# EAGLE design MainBoard (EAGLE 7.1.0)
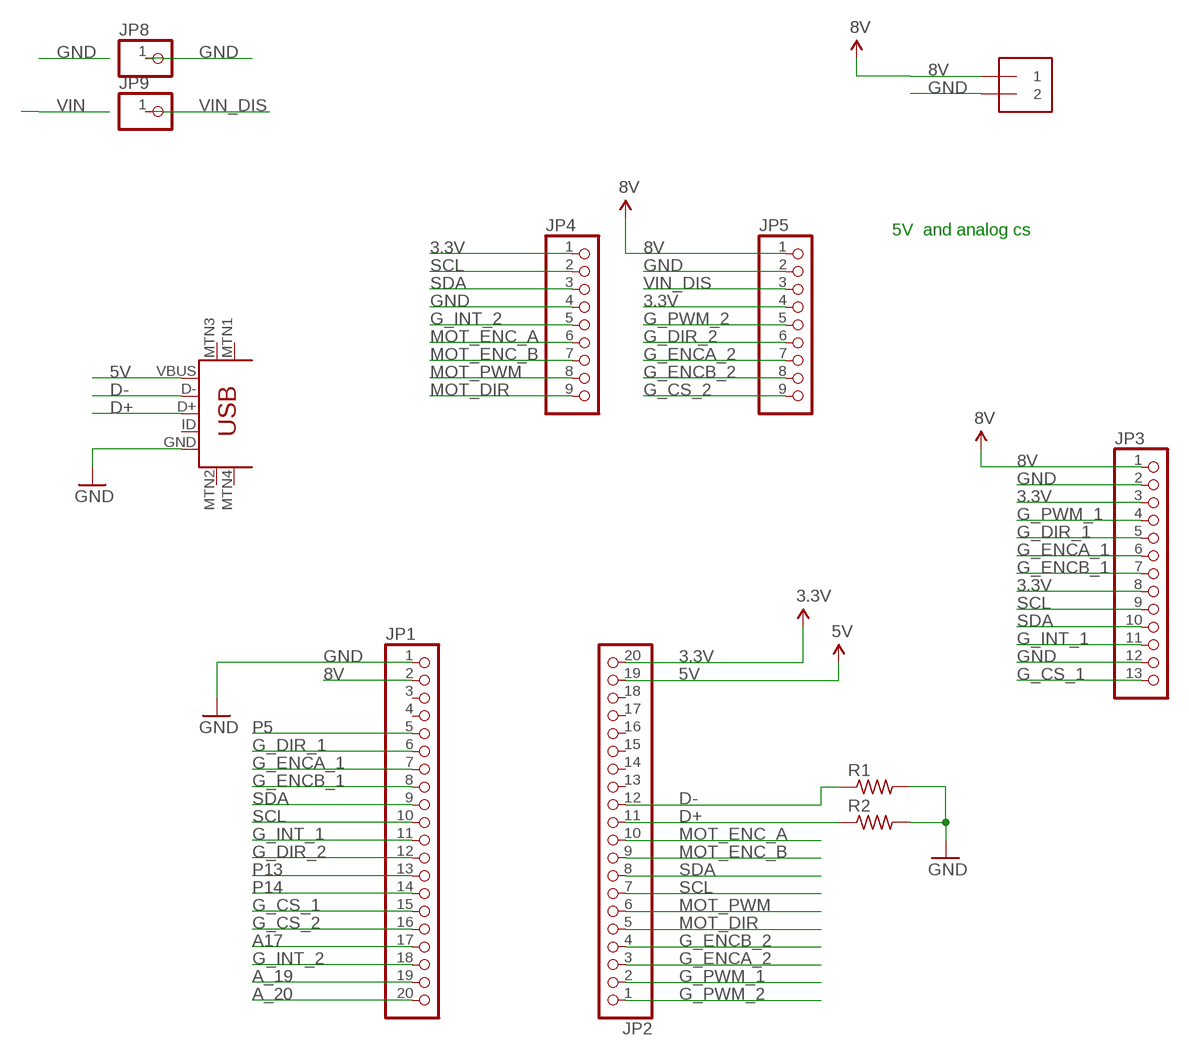
[diagram p0: schematic, sheet 1]

## Parts
J1  1X2-3.5MM  [1X2-3.5MM]
JP1  PINHD-1X20  [1X20]
JP2  PINHD-1X20  [1X20]
JP3  PINHD-1X13  [1X13]
JP4  PINHD-1X9  [1X09-BIG]
JP5  PINHD-1X9  [1X09-BIG]
JP8  PINHD-1X1  [1X01]
JP9  PINHD-1X1  [1X01]
R1  RES-US1206  [R1206]
R2  RES-US1206  [R1206]
U$1  USB-MINIB-5PIN  [USB-MINIB]

## Nets
3.3V: JP2.20 JP3.3 JP3.8 JP4.1 JP5.4
5V: JP2.19 U$1.VBUS
8V: J1.1 JP1.2 JP3.1 JP5.1
A17: JP1.17
A_19: JP1.19
A_20: JP1.20
D+: JP2.11 R2.1 U$1.D+
D-: JP2.12 R1.1 U$1.D-
G_CS_1: JP1.15 JP3.13
G_CS_2: JP1.16 JP5.9
G_DIR_1: JP1.6 JP3.5
G_DIR_2: JP1.12 JP5.6
G_ENCA_1: JP1.7 JP3.6
G_ENCA_2: JP2.3 JP5.7
G_ENCB_1: JP1.8 JP3.7
G_ENCB_2: JP2.4 JP5.8
G_INT_1: JP1.11 JP3.11
G_INT_2: JP1.18 JP4.5
G_PWM_1: JP2.2 JP3.4
G_PWM_2: JP2.1 JP5.5
GND: J1.2 JP1.1 JP3.2 JP3.12 JP4.4 JP5.2 JP8.1 R1.2 R2.2 U$1.GND
MOT_DIR: JP2.5 JP4.9
MOT_ENC_A: JP2.10 JP4.6
MOT_ENC_B: JP2.9 JP4.7
MOT_PWM: JP2.6 JP4.8
P5: JP1.5
P13: JP1.13
P14: JP1.14
SCL: JP1.10 JP2.7 JP3.9 JP4.2
SDA: JP1.9 JP2.8 JP3.10 JP4.3
VIN_DIS: JP5.3 JP9.1
Unconnected: JP1.3 JP1.4 JP2.13 JP2.14 JP2.15 JP2.16 JP2.17 JP2.18 U$1.ID U$1.MTN1(MTN2) U$1.MTN2(MTN3) U$1.MTN3(MTN1) U$1.MTN4

## Notes on the sheet
- 5V  and analog cs

## Library data of the parts
J1 = adafruit:1X2: 3.5mm Terminal block http://www.ladyada.net/library/pcb/eaglelibrary.html
JP1 JP2 = adafruit:PINHD-1X20: PIN HEADER
JP3 = adafruit:PINHD-1X13: PIN HEADER
JP4 JP5 = adafruit:PINHD-1X9: Pin header 1x10 0.1" spacing With round pins
JP8 JP9 = adafruit:PINHD-1X1: Pin header 1x1 for 0.1" spacing With round pins
R1 R2 = fab:RES-US: Resistor (US Symbol) Variants with postfix FAB are widened to allow the routing of internal traces
U$1 = SparkFun:USB-MINIB: Mini-USB "B" connector with 5th pin broken out. Created new symbol breaking out 5th "ID" pin in mini/micro USB connector spec. See: http://en.wikipedia.org/wiki/Mini_usb#Cables. Uses same footprint as 4-pin symbol. Also added pins to connect to mounting / shield pads if required (probably not generally needed as signals aren't shielded once they leave the connector).

## Board
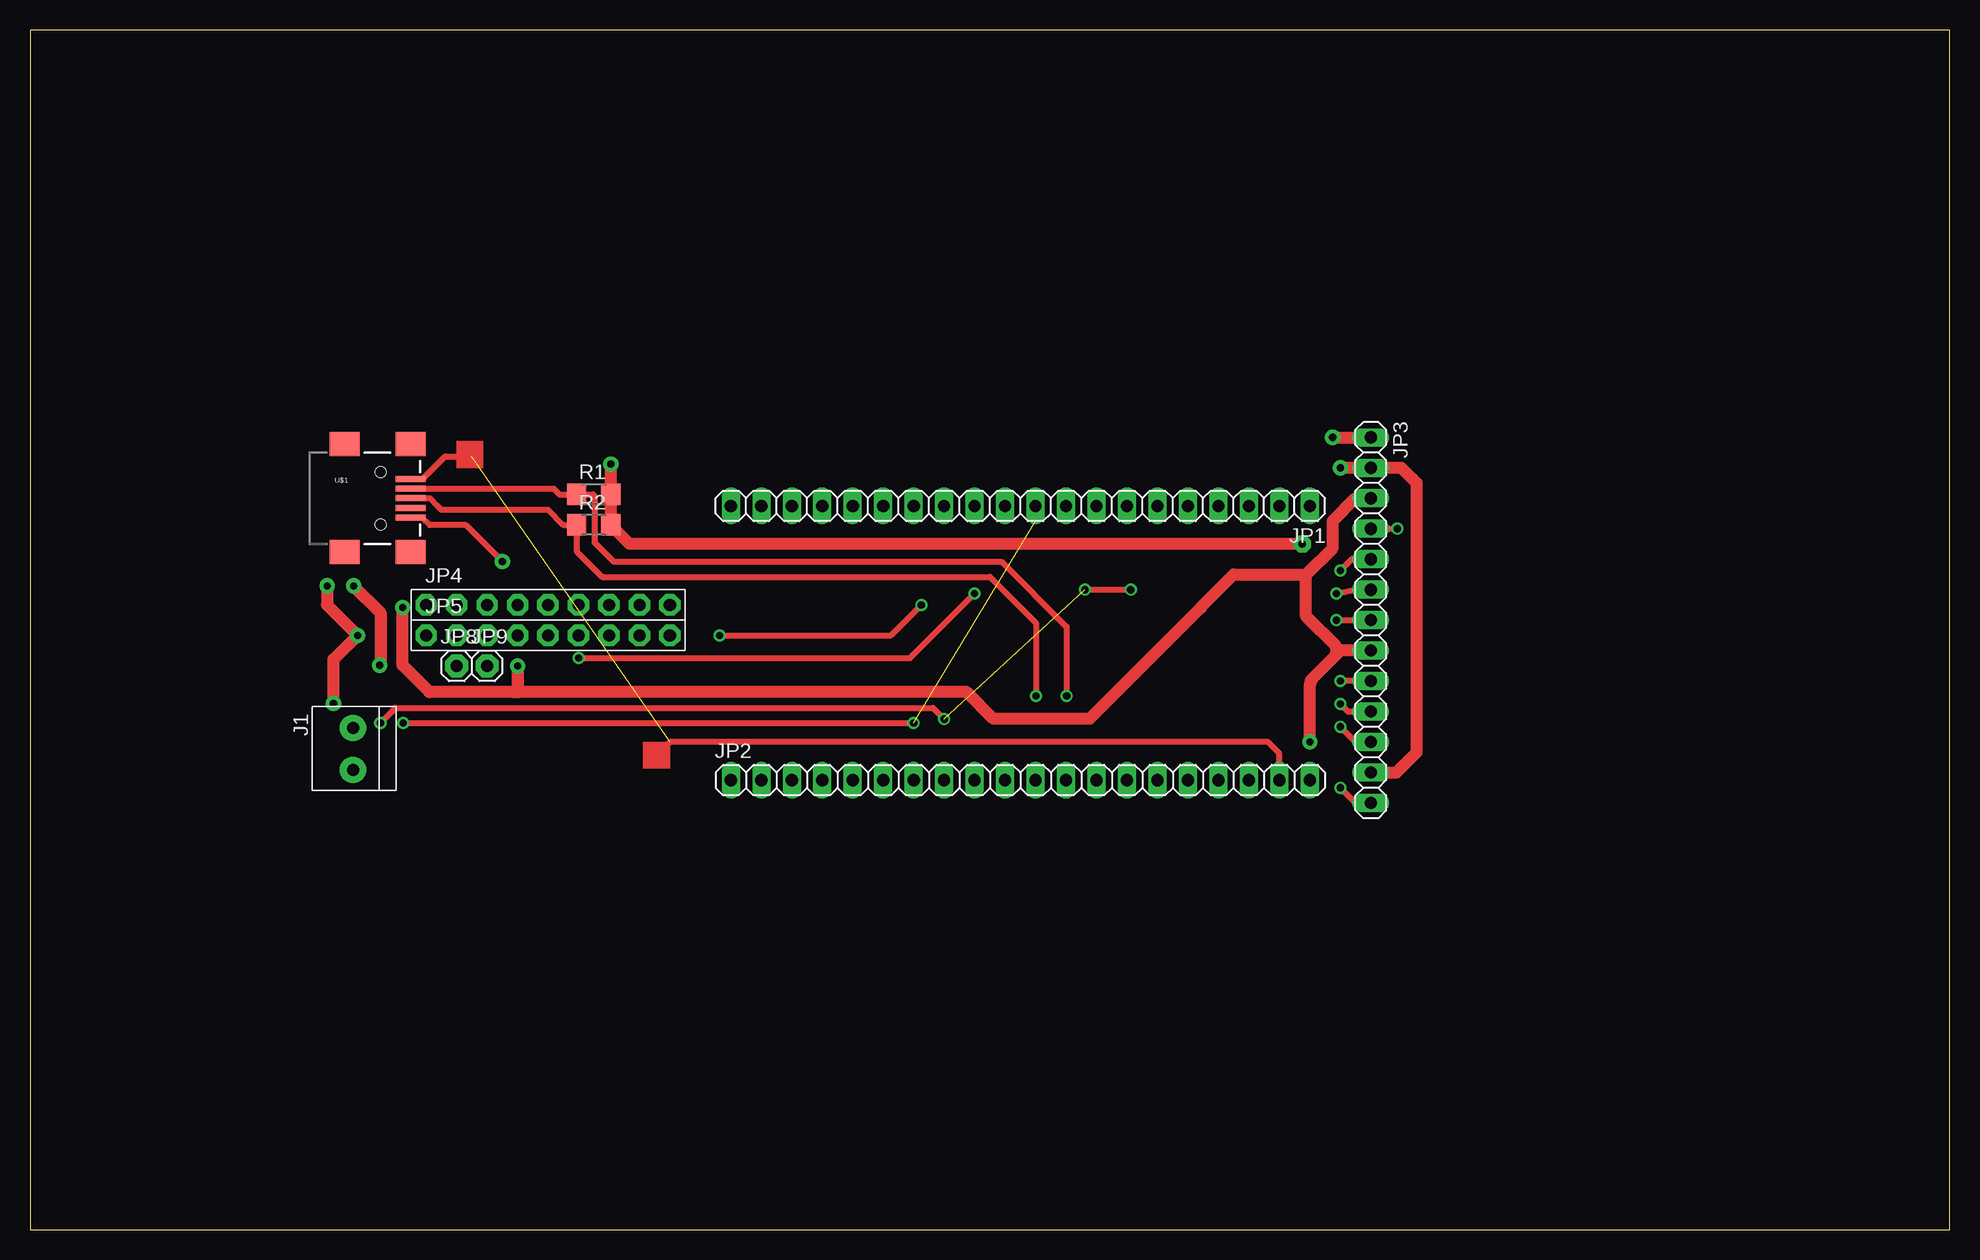
[diagram p1: board, top side]
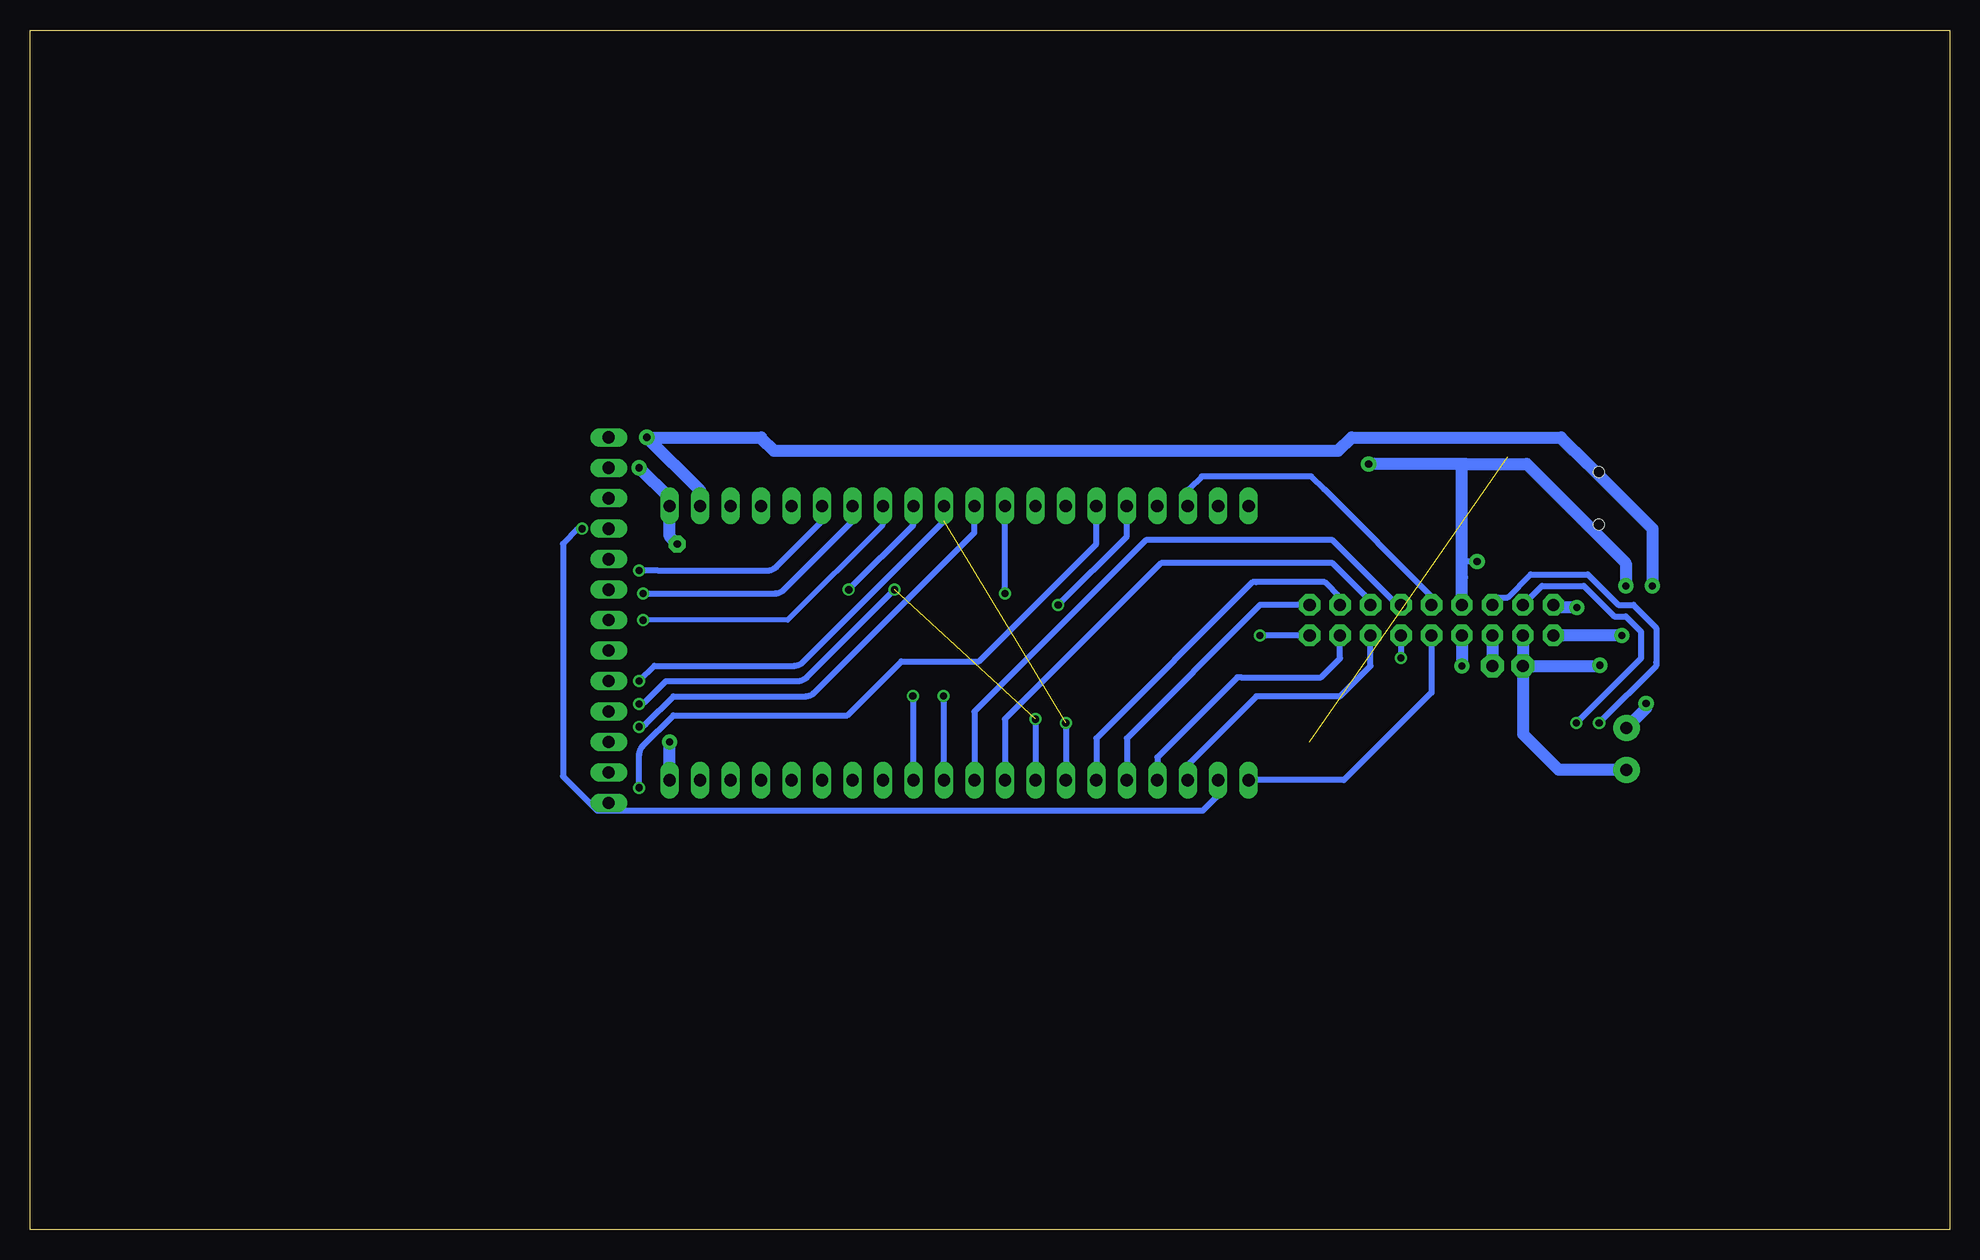
[diagram p2: board, bottom side, seen from below]

Size 160 x 100 mm. Coordinates in mm from the lower left corner, seen from the top.
Outline: 0,0 160,0 160,100 0,100 0,0
Copper layers (1*16): Top 0.035mm / dielectric 1.5mm / Bottom 0.035mm
Design rules "default": minimum track width 10mil, minimum drill 24mil, track to track 8mil, track to pad 8mil, pad to pad 8mil, via to via 8mil, smd to smd 8mil, copper to edge 40mil, drill to drill 8mil, minimum pad ring 10mil, minimum via ring 8mil, stop-mask expansion 4mil, vias tented up to drill 0mil, thermal gap 10mil

### Footprints (pad centres in the part's own frame; a part is rotated, then mirrored left to right if it is on the bottom)
1X2-3.5MM = drill 1 pad 2.184: 1 1.8,0; 2 -1.7,0
1X20 = drill 1.016 long: 1 -24.13,0; 2 -21.59,0; 3 -19.05,0; 4 -16.51,0; 5 -13.97,0; 6 -11.43,0; 7 -8.89,0; 8 -6.35,0; 9 -3.81,0; 10 -1.27,0; 11 1.27,0; 12 3.81,0; 13 6.35,0; 14 8.89,0; 15 11.43,0; 16 13.97,0; 17 16.51,0; 18 19.05,0; 19 21.59,0; 20 24.13,0
1X13 = drill 1.016 long: 1 -15.24,0; 2 -12.7,0; 3 -10.16,0; 4 -7.62,0; 5 -5.08,0; 6 -2.54,0; 7 0,0; 8 2.54,0; 9 5.08,0; 10 7.62,0; 11 10.16,0; 12 12.7,0; 13 15.24,0
1X09-BIG = drill 1.016 pad 1.778 octagon: 1 -10.16,0; 2 -7.62,0; 3 -5.08,0; 4 -2.54,0; 5 0,0; 6 2.54,0; 7 5.08,0; 8 7.62,0; 9 10.16,0
1X01 = drill 1.016 pad 1.93 octagon: 1 0,0
R1206 = smd 1.6 x 1.803: 1 -1.422,0; 2 1.422,0
USB-MINIB = smd 2.5 x 0.5: D+ 2.5,0; D- 2.5,0.8; GND 2.5,-1.6; ID 2.5,-0.8; VBUS 2.5,1.6 | smd 2.5 x 2: MTN1 -3,4.5; MTN2 2.5,4.5; MTN3 -3,-4.5; MTN4 2.5,-4.5 | hole 0.9: 0,2.2; 0,-2.2

### Placement (x,y rotation side)
J1  26.92,40.02 90 top
JP1  82.55,60.33 180 top
JP2  82.55,37.47 0 top
JP3  111.76,50.8 270 top
JP4  43.18,52.07 0 top
JP5  43.18,49.53 0 top
JP8  35.56,46.99 0 top
JP9  38.1,46.99 0 top
R1  46.99,61.28 0 top
R2  46.99,58.74 0 top
U$1  29.21,60.96 0 top

### Tracks (layer width: path | path; a pad name or v marks a point on that pad's centre or on a via)
3.3V  (via drill 0.6 pad 1.27)
  Top 1.016: JP3.8 109.22,48.26 | v106.68,40.64 106.68,45.3 arc-45 106.98,46.02 109.22,48.26 | 109.22,48.26 108.88,48.26 108.88,48.6 106.36,51.12 106.36,54.61 | 40.32,44.81 40.66,44.81 78.09,44.81 80.33,42.56 88.33,42.56 97.61,51.85 97.61,51.89 99.06,53.34 100.33,54.61 106.36,54.61 | 40.32,44.81 33.3,44.81 31.06,47.05 v31.06,51.85 | JP3.3 110.49,60.96 108.58,59.05 108.58,56.83 106.36,54.61 | v40.64,46.99 40.64,45.12 40.32,44.81
  Bottom 1.016: JP2.20 v106.68,40.64 | v31.06,51.85 32.8,51.85 JP4.1 | JP5.4 v40.64,46.99
5V  (1 unrouted)
  Top 0.406: 36.51,64.45 36.83,64.45
  Top 0.508: 36.83,64.45 34.61,64.45 32.72,62.56 U$1.VBUS | JP2.19 104.14,39.69 103.19,40.64 53.34,40.64 52.39,39.69
8V  (via drill 0.6 pad 1.27)
  Top 1.016: v108.58,66.04 JP3.1 | v25.3,43.84 25.3,47.52 v27.3,49.53 24.77,52.07 v24.77,53.66
  Bottom 1.016: v27.3,49.53 JP5.1 | JP1.2 104.14,61.59 v108.58,66.04 99.06,66.04 99.06,65.99 97.99,64.92 50.97,64.92 49.85,66.04 32.38,66.04 30.16,63.82 24.77,58.42 v24.77,53.66 | v25.3,43.84 25.3,43.44 J1.1
D+  (via drill 0.6 pad 0.81)
  Top 0.508: v83.85,44.49 83.85,50.57 80.01,54.41 47.7,54.41 45.57,56.54 R2.1 44.45,58.74 43.18,60.01 34.29,60.01 33.97,60.33 33.34,60.96 U$1.D+
  Bottom 0.508: v83.85,44.49 83.85,44.17 83.85,37.49 JP2.11
D-  (via drill 0.6 pad 0.81)
  Top 0.508: R1.1 46.91,61.28 47.06,61.13 47.06,57.29 48.66,55.69 80.97,55.69 86.41,50.25 v86.41,44.49 | 45.42,61.12 R1.1 | U$1.D- 43.65,61.76 44.13,61.28 R1.1
  Bottom 0.508: v86.41,44.49 86.41,37.52 JP2.12
G_CS_1  (via drill 0.6 pad 0.81)
  Top 0.508: JP3.13 110.91,35.56 110.49,35.56 v109.22,36.83
  Bottom 0.508: v109.22,36.83 109.22,39.58 arc45 108.92,40.3 106.36,42.86 91.87,42.86 87.37,47.37 80.9,47.37 71.12,57.15 JP1.15
G_CS_2  (via drill 0.6 pad 0.81)
  Top 0.508: v57.47,49.53 71.75,49.53 v74.3,52.07
  Bottom 0.508: JP5.9 v57.47,49.53 | v74.3,52.07 68.58,57.78 JP1.16
G_DIR_1  (via drill 0.6 pad 0.81)
  Top 0.508: JP3.5 110.17,55.88 v109.22,54.93
  Bottom 0.508: JP1.6 93.98,59.05 97.81,55.23 arc45 98.53,54.93 107.63,54.93 v109.22,54.93
G_DIR_2  (via drill 0.6 pad 0.81)
  Top 0.508: v45.72,47.63 73.35,47.63 v78.74,53.02
  Bottom 0.508: JP5.6 v45.72,47.63 | v78.74,53.02 JP1.12
G_ENCA_1  (via drill 0.6 pad 0.81)
  Top 0.508: v108.9,53.02 108.92,53 110.49,53.34 JP3.6
  Bottom 0.508: v108.9,53.02 97.89,53.02 arc-45 97.17,53.32 91.44,59.05 JP1.7
G_ENCA_2
  Bottom 0.508: JP2.3 63.5,38.73 57.78,44.45 50.8,44.45 48.48,46.77 48.26,46.99 JP5.7
G_ENCB_1  (via drill 0.6 pad 0.81)
  Top 0.508: JP3.7 111.23,50.8 110.81,50.8 v108.9,50.8
  Bottom 0.406: 88.9,59.05 88.9,58.74 96.84,50.8 v108.9,50.8
  Bottom 0.508: 88.9,59.05 JP1.8
G_ENCB_2
  Bottom 0.508: JP2.4 66.04,38.1 | 66.04,38.1 66.04,38.73 | JP5.8 50.8,47.62 52.39,46.04 59.05,46.04 59.37,46.04 66.04,39.37 66.04,38.1
G_INT_1  (via drill 0.6 pad 0.81)
  Top 0.508: JP3.11 110.91,40.64 110.49,40.64 110.17,40.96 v109.22,41.91
  Bottom 0.508: v109.22,41.91 arc-45 108.68,42.13 106.36,44.45 95.35,44.45 arc-45 94.64,44.75 81.28,58.1 JP1.11
G_INT_2
  Bottom 0.508: JP4.5 43.18,52.78 52.12,61.72 53.19,62.79 62.33,62.79 63.4,61.72 63.4,60.43 JP1.18
G_PWM_1  (via drill 0.6 pad 0.81)
  Top 0.508: JP3.4 v113.98,58.42
  Bottom 0.508: v113.98,58.42 114.3,58.42 115.57,57.15 115.57,37.78 113.03,35.24 112.71,34.92 73.34,34.92 62.23,34.92 60.96,36.2 JP2.2
G_PWM_2
  Bottom 0.508: JP5.5 43.18,44.77 50.48,37.47 JP2.1
GND  (via drill 0.6 pad 1.27, 0.6 pad 1.42)
  Top 0.508: v39.38,55.69 36.34,58.73 33.35,58.73 32.7,59.37 31.72,59.37 U$1.GND
  Top 1.016: JP3.12 113.88,38.1 115.57,39.79 115.57,62.23 | v48.41,63.82 R1.2 R2.2 50,57.15 v106.05,57.15 | v29.14,47.05 29.21,47.12 29.21,51.44 v26.99,53.66 | v109.22,63.5 JP3.2 114.3,63.5 115.27,62.53 | 115.27,62.53 115.57,62.23 | 115.27,62.53 115.57,62.23
  Bottom 0.508: v39.38,55.69 40.66,55.69
  Bottom 1.016: JP1.1 106.55,59.65 106.68,59.79 | 40.34,63.82 44.77,63.82 v48.41,63.82 | JP4.4 40.64,54.39 40.66,54.41 40.66,55.69 40.66,63.5 40.34,63.82 | JP5.2 JP8.1 | JP8.1 29.2,46.99 v29.14,47.05 | J1.2 32.57,38.32 35.54,41.28 35.54,46.97 JP8.1 | JP1.1 106.68,60.96 v109.22,63.5 | v106.05,57.15 106.68,57.78 JP1.1 | 40.34,63.82 35.24,63.82 26.99,55.56 v26.99,53.66
MOT_DIR
  Bottom 0.508: JP4.9 57.47,52.07 68.58,40.96 JP2.5
MOT_ENC_A
  Bottom 0.508: JP4.6 46.04,52.07 51.44,57.47 66.99,57.47 81.28,43.18 JP2.10
MOT_ENC_B
  Bottom 0.508: JP4.7 48.26,52.39 51.44,55.56 65.72,55.56 78.74,42.55 JP2.9
MOT_PWM
  Bottom 0.508: JP4.8 50.8,52.7 52.07,53.98 57.78,53.98 58.1,53.98 71.12,40.96 JP2.6
SCL  (via drill 0.6 pad 0.81)  (1 unrouted)
  Top 0.508: JP3.9 v109.22,45.72 | v31.11,42.23 v73.66,42.23
  Bottom 0.508: v109.22,45.72 107.95,46.99 96.31,46.99 arc-45 95.59,47.29 83.82,59.05 JP1.10 | v31.11,42.23 25.72,47.62 25.72,49.85 26.99,51.12 27.94,51.12 30.48,53.66 33.97,53.66 JP4.2 | v73.66,42.23 JP2.7
SDA  (via drill 0.6 pad 0.81)  (1 unrouted)
  Top 0.508: v109.22,43.81 109.56,43.48 109.86,43.18 JP3.10 | v87.95,53.34 v91.76,53.34 | v29.21,42.23 30.48,43.49 75.25,43.49 v76.2,42.55
  Bottom 0.508: v109.22,43.81 arc-45 108.68,44.04 107,45.72 95.99,45.72 arc-45 95.27,46.02 v87.95,53.34 | v91.76,53.34 86.36,58.74 JP1.9 | v29.21,42.23 24.45,46.99 24.45,47.31 24.45,50.16 26.35,52.07 27.62,52.07 30.16,54.61 34.92,54.61 36.83,52.7 38.1,52.7 JP4.3 | v76.2,42.55 JP2.8
VIN_DIS
  Bottom 1.016: JP5.3 JP9.1
(copper drawn outside any net)
  shapes: Top area x2